# Altium schematic sheet Gateway_V2.0_Final_Schematic.SchDoc
size A2; SheetNumber: 1; SheetTotal: 1
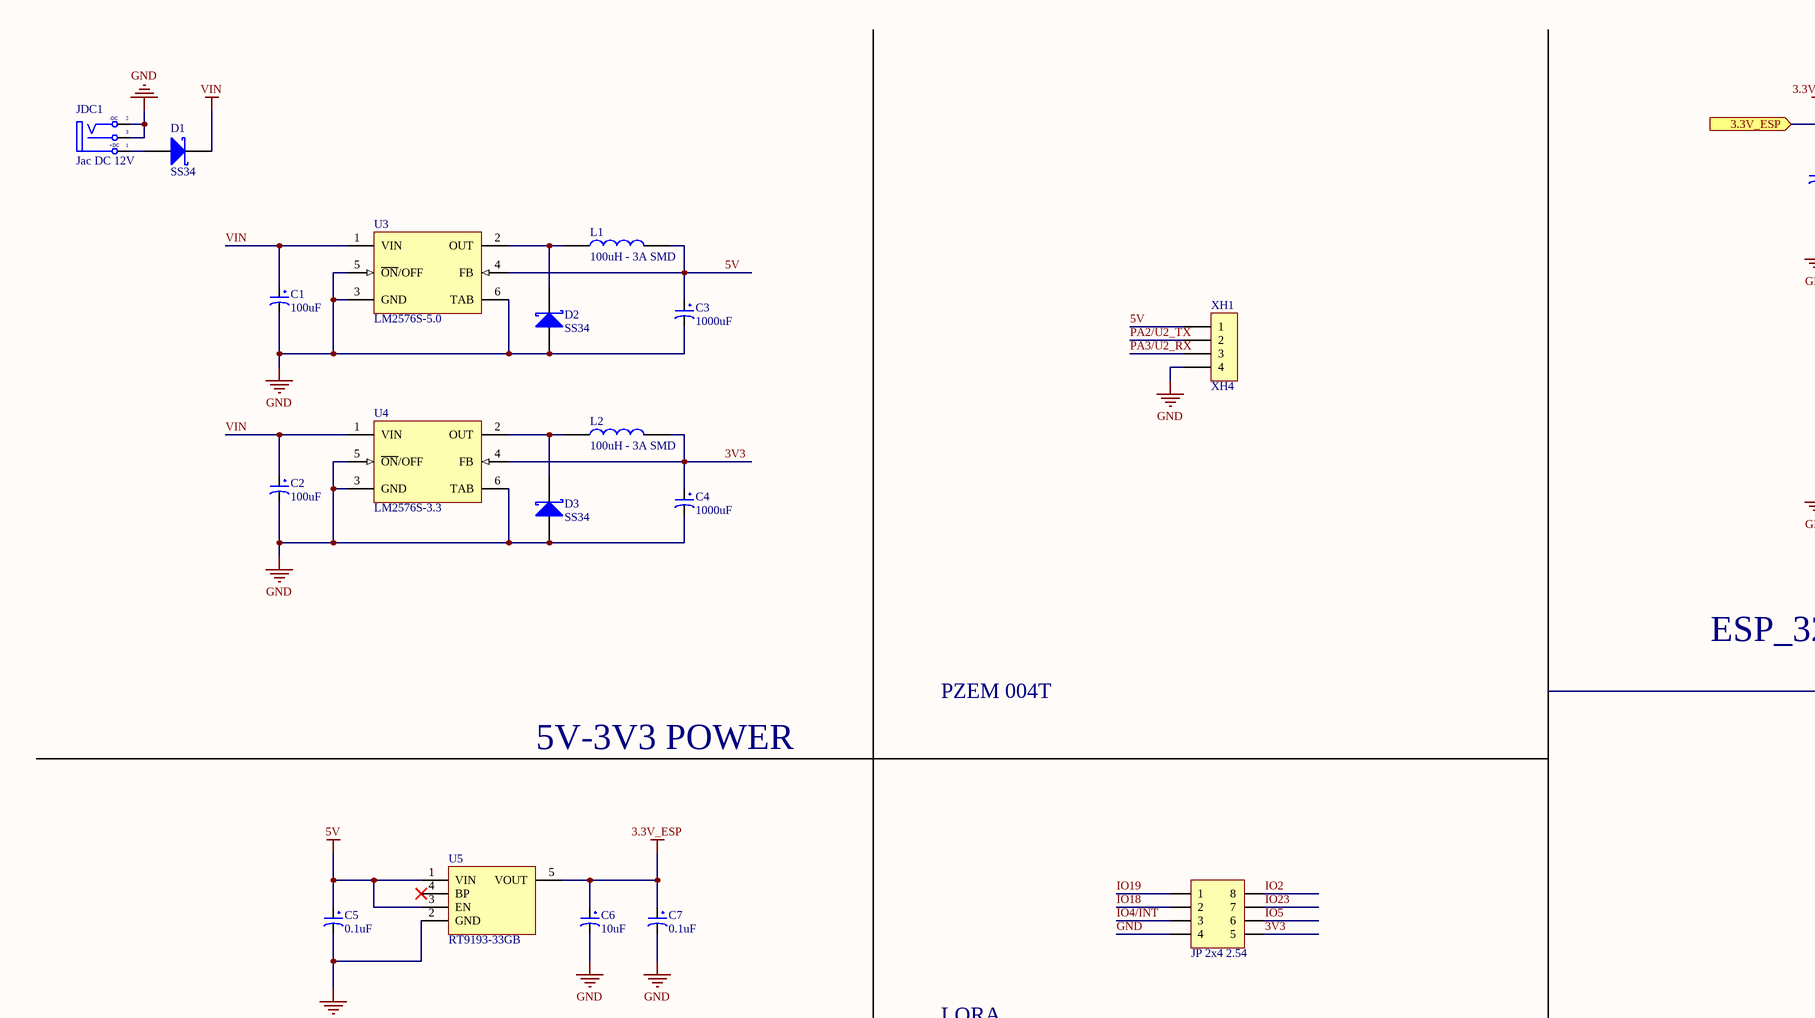
[diagram p0: Gateway_V2.0_Final_Schematic.SchDoc, top left]
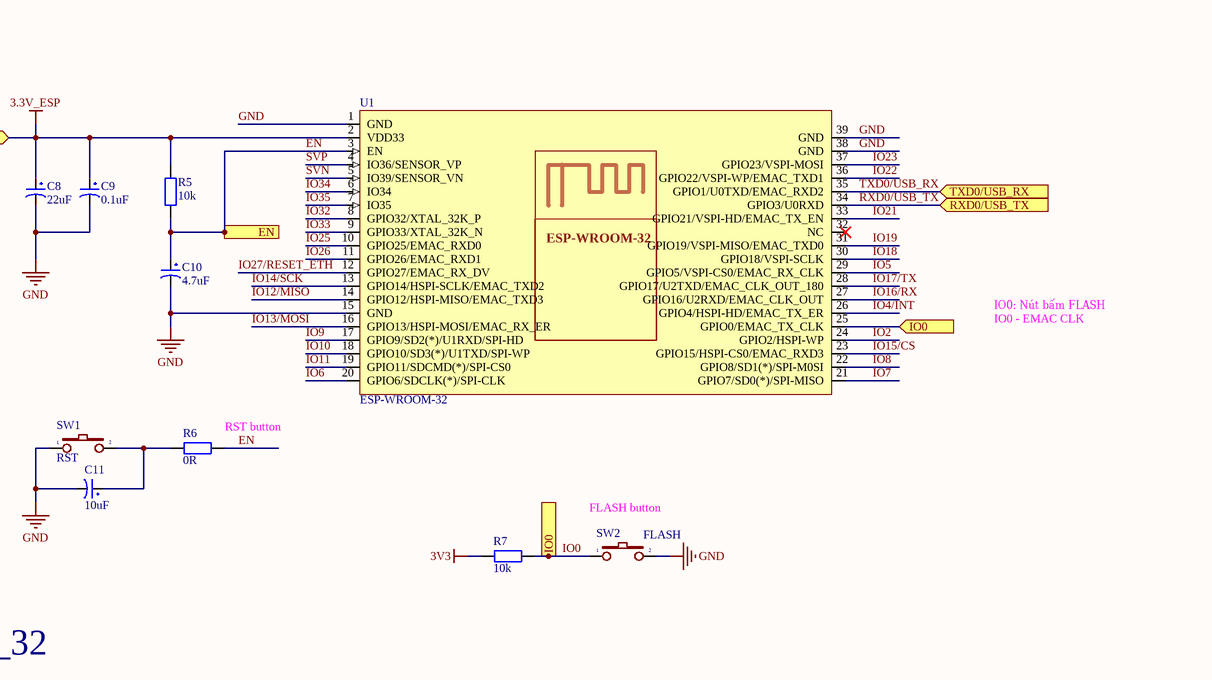
[diagram p1: Gateway_V2.0_Final_Schematic.SchDoc, top right]
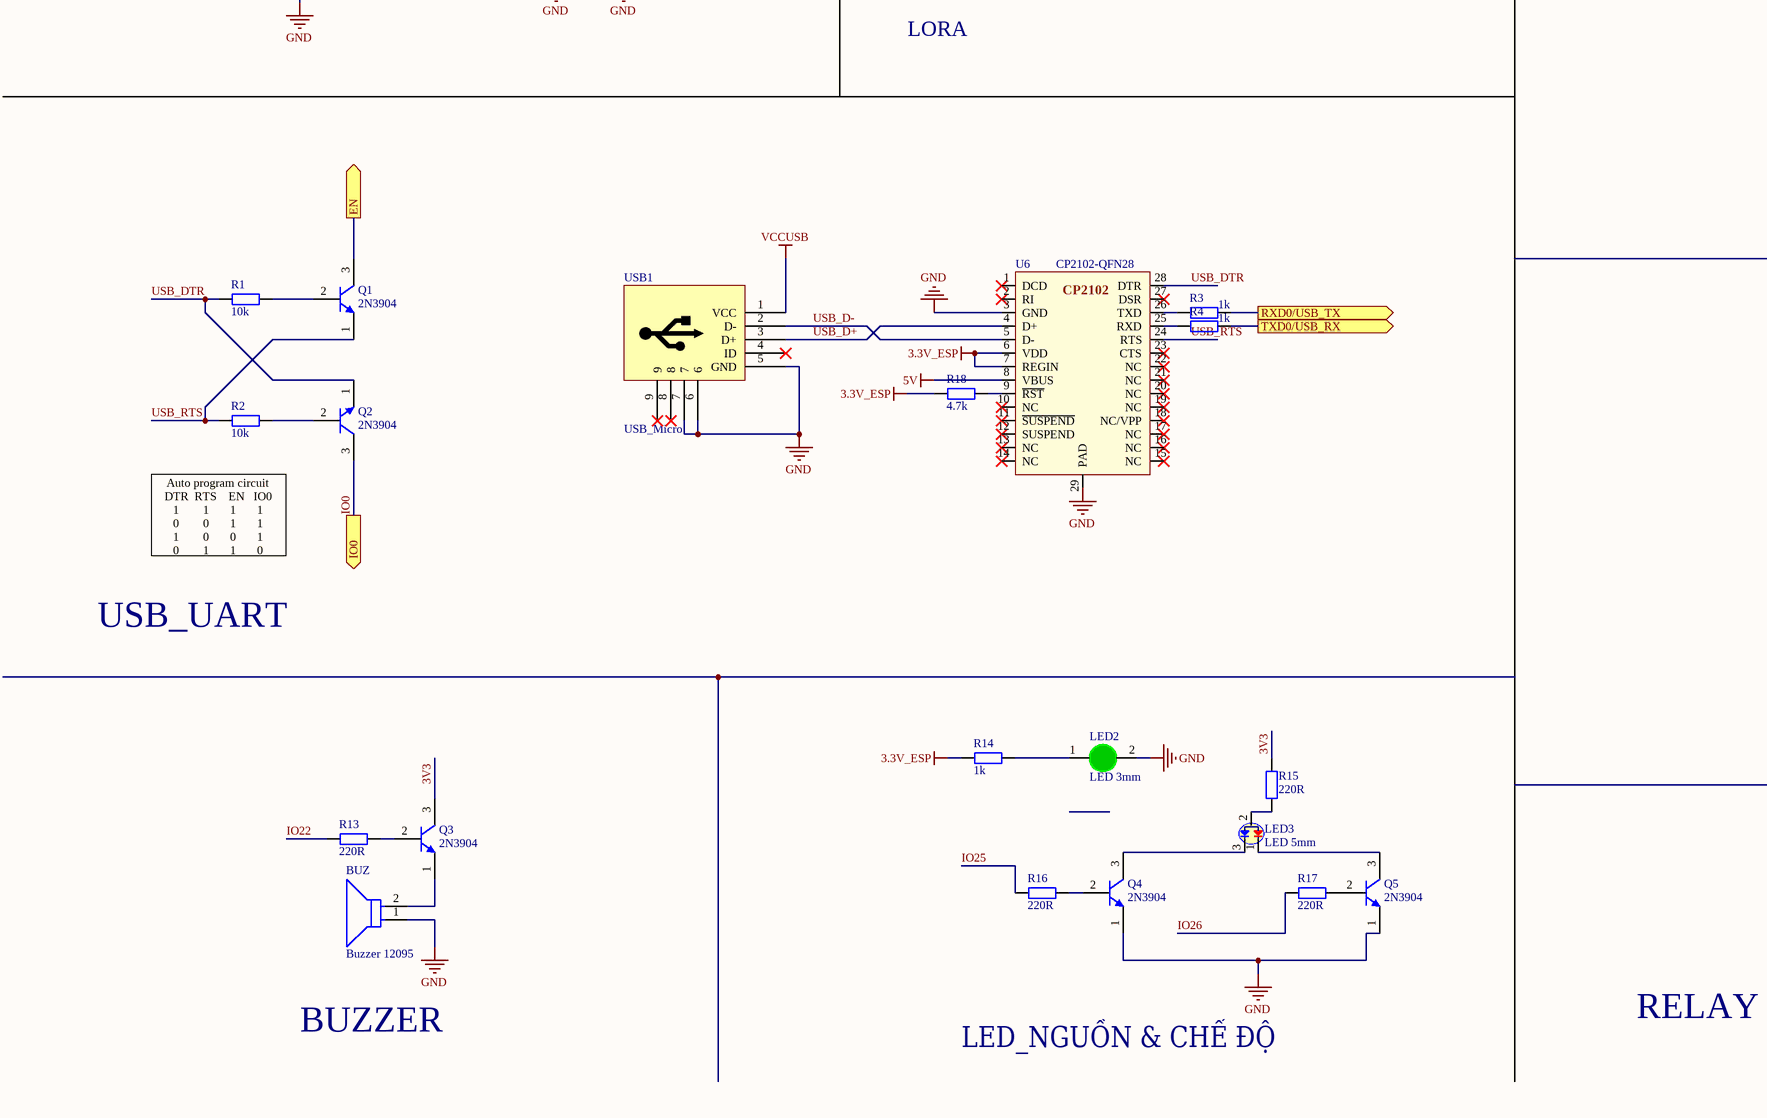
[diagram p2: Gateway_V2.0_Final_Schematic.SchDoc, bottom left]
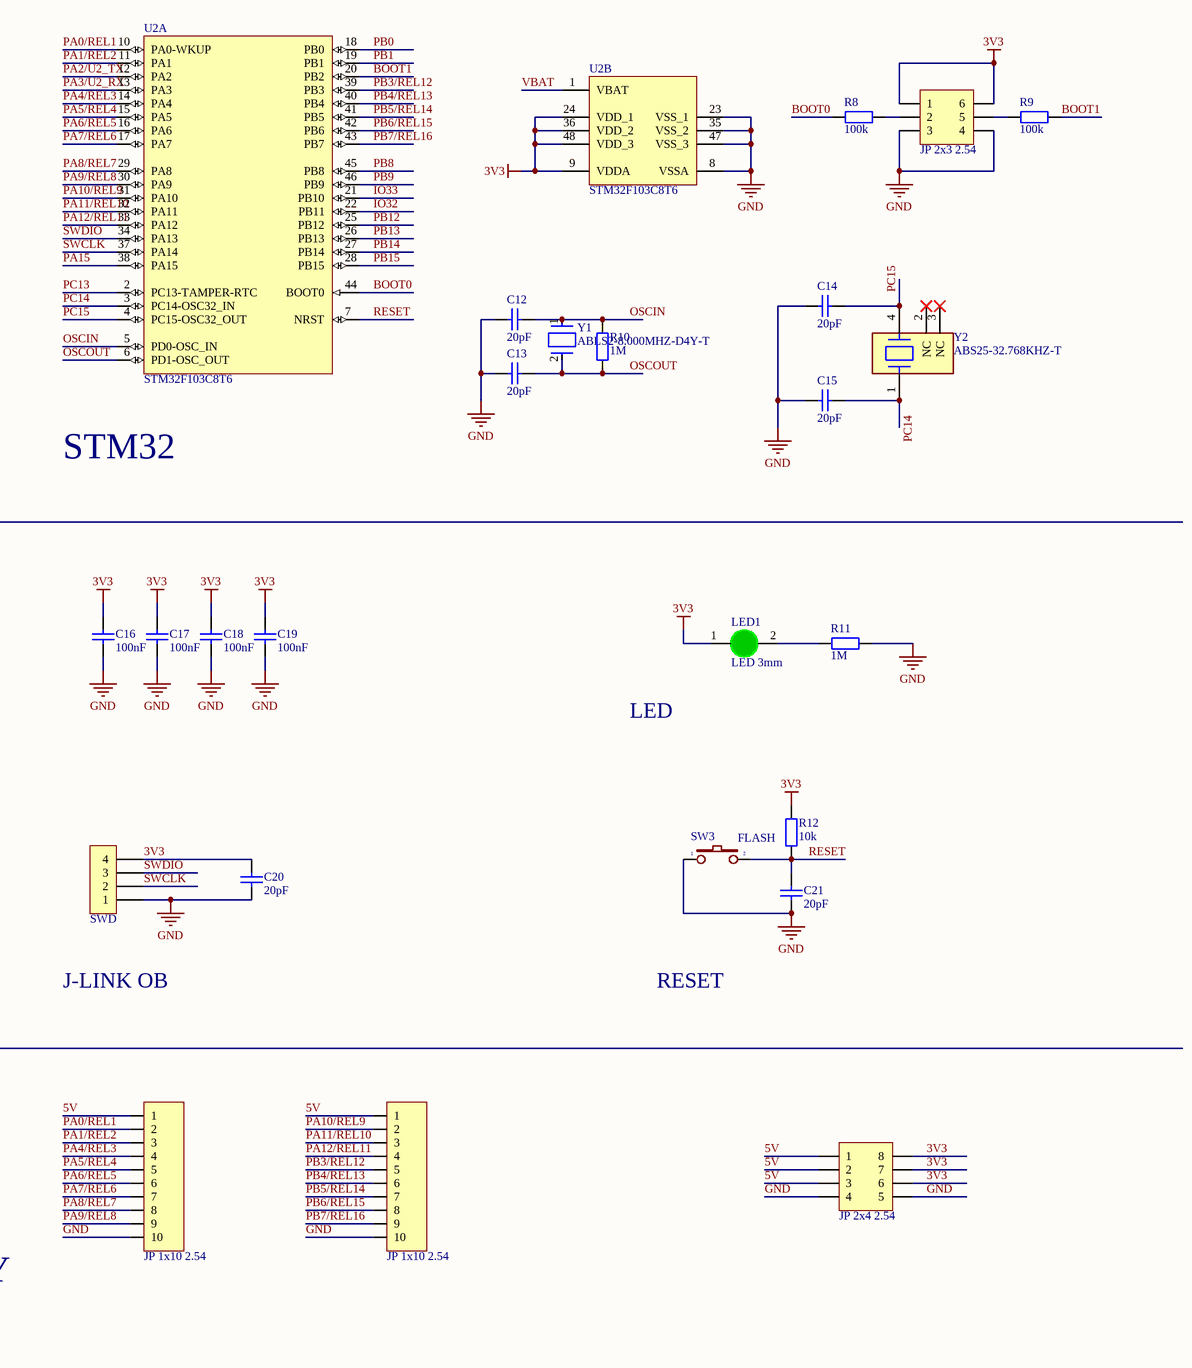
[diagram p3: Gateway_V2.0_Final_Schematic.SchDoc, bottom right]

## Parts
(Parts that share a designator on the sheet are numbered #1, #2 ... from top to bottom, then left to right.)
BUZ  Buzzer 12095  [FP-MCKPX-G1203A-K4056-MFG]
C1  100uF  [tu hoa 5mm]
C2  100uF  [tu hoa 5mm]
C3  1000uF  [tu hoa 8mm]
C4  1000uF  [tu hoa 8mm]
C5  0.1uF  [tu hoa 5mm]
C6  10uF  [tu hoa 4mm]
C7  0.1uF  [tu hoa 5mm]
C8  22uF  [tu hoa 5mm]
C9  0.1uF  [tu hoa 5mm]
C10  4.7uF  [tu hoa 5mm]
C11  10uF  [tu hoa 4mm]
C12  20pF  [tu gom]
C13  20pF  [tu gom]
C14  20pF  [tu gom]
C15  20pF  [tu gom]
C16  100nF  [tu tantalum dip5.08]
C17  100nF  [tu tantalum dip5.08]
C18  100nF  [tu tantalum dip5.08]
C19  100nF  [tu tantalum dip5.08]
C20  20pF  [tu gom]
C21  20pF  [tu gom]
D1  SS34  [SS14]
D2  SS34  [SS14]
D3  SS34  [SS14]
H1  SWD  [Header 4P DC 2.54]
JDC1  Jac DC 12V  [DC-IN]
JP3  JP 2x3 2.54  [JP 2x3 DT]
JP4  JP 1x10 2.54  [JP 1x10 DT]
JP5  JP 1x10 2.54  [JP 1x10 DT]
JP6  JP 2x4 2.54  [JP 2x4 CT]
L1  100uH - 3A SMD  [Cuon Cam 12x12x10]
L2  100uH - 3A SMD  [Cuon Cam 12x12x10]
LED1  LED 3mm  [LED-3MM-GREEN]
LED2  LED 3mm  [LED-3MM-GREEN]
LED3  LED 5mm  [LED-5MM 2 MAU]
LORA  JP 2x4 2.54  [JP 2x4 CT]
Q1  2N3904  [ONSC-TO-92-3-29-11]
Q2  2N3904  [ONSC-TO-92-3-29-11]
Q3  2N3904  [ONSC-TO-92-3-29-11]
Q4  2N3904  [ONSC-TO-92-3-29-11]
Q5  2N3904  [ONSC-TO-92-3-29-11]
R1  10k  [tro vach 1/4w]
R2  10k  [tro vach 1/4w]
R3  1k  [tro vach 1/4w]
R4  1k  [tro vach 1/4w]
R5  10k  [tro vach 1/4w]
R6  0R  [tro vach 1/4w]
R7  10k  [tro vach 1/4w]
R8  100k  [tro vach 1/4w]
R9  100k  [tro vach 1/4w]
R10  1M  [tro vach 1/4w]
R11  1M  [tro vach 1/4w]
R12  10k  [tro vach 1/4w]
R13  220R  [tro vach 1/4w]
R14  1k  [tro vach 1/4w]
R15  220R  [tro vach 1/4w]
R16  220R  [tro vach 1/4w]
R17  220R  [tro vach 1/4w]
R18  4.7k  [tro vach 1/4w]
SW1  RST  [Button 3x4mm]
SW2  FLASH  [Button 3x4mm]
SW3  FLASH  [Button 3x4mm]
U1  ESP-WROOM-32  [ESP32 WROOM]
U2#1  STM32F103C8T6  [STM-LQFP48_L]  (part A of 2)
U2#2  STM32F103C8T6  [STM-LQFP48_L]  (part B of 2)
U3  LM2576S-5.0  [KTT0005B_N]
U4  LM2576S-3.3  [TS5B_M]
U5  RT9193-33GB  [SOT23-5]
U6  CP2102-QFN28  [CP2102-QFN28]
USB1  USB_Micro  [USB_MICRO_B - Digikey]
XH1  XH4  [XH4/2.54mm/90]
Y1  ABLS2-8.000MHZ-D4Y-T  [FP-ABLS2-MFG]
Y2  ABS25-32.768KHZ-T  [FP-ABS25-MFG]

## Ports
3.3V_ESP (in), EN (in, see Gateway_V2.0_Final_Schematic[2C]), EN (out, see Gateway_V2.0_Final_Schematic[6A]), IO0 (in, see Gateway_V2.0_Final_Schematic[2C], Gateway_V2.0_Final_Schematic[7B]), IO0 (out, see Gateway_V2.0_Final_Schematic[2C], Gateway_V2.0_Final_Schematic[8A]), IO0 (out, see Gateway_V2.0_Final_Schematic[7B], Gateway_V2.0_Final_Schematic[8A]), RXD0/USB_TX (in, see Gateway_V2.0_Final_Schematic[4C]), RXD0/USB_TX (out, see Gateway_V2.0_Final_Schematic[8A]), TXD0/USB_RX (in, see Gateway_V2.0_Final_Schematic[4C]), TXD0/USB_RX (out, see Gateway_V2.0_Final_Schematic[8A])

## Nets
3.3V_ESP: C6.1 C7.1 C8.1 C9.1 R5.1 R14.1 R18.1 U1.2(VDD33) U5.5(VOUT) U6.6(VDD) U6.7(REGIN) ; port 3.3V_ESP
3V3: C4.1 C16.1 C17.1 C18.1 C19.1 C20.1 H1.4 JP3.1 JP3.6 JP6.6 JP6.7 JP6.8 L2.2 LED1.1(A) LORA.5 Q3.3(C) R7.1 R12.2 R15.2 U2#2.9(VDDA) U2#2.24(VDD_1) U2#2.36(VDD_2) U2#2.48(VDD_3) U4.4(FB)
5V: C3.1 C5.1 JP4.1 JP5.1 JP6.1 JP6.2 JP6.3 L1.2 U3.4(FB) U5.1(VIN) U5.3(EN) U6.8(VBUS) XH1.1
GND: BUZ.1(C) C1.2 C2.2 C3.2 C4.2 C5.2 C6.2 C7.2 C8.2 C9.2 C10.2 C11.2 C12.1 C13.2 C14.2 C15.2 C16.2 C17.2 C18.2 C19.2 C20.2 C21.2 D2.1(A) D3.1(A) H1.1 JDC1.2(TN) JDC1.3(S) JP3.3 JP3.4 JP4.10 JP5.10 JP6.4 JP6.5 LED2.2(K) LORA.4 Q4.1(E) Q5.1(E) R11.2 SW1.1 SW2.2 SW3.1 U1.1(GND) U1.15(GND) U1.38(GND) U1.39(GND) U2#2.8(VSSA) U2#2.23(VSS_1) U2#2.35(VSS_2) U2#2.47(VSS_3) U3.3(GND) U3.5(~{ON}/OFF) U3.6(TAB) U4.3(GND) U4.5(~{ON}/OFF) U4.6(TAB) U5.2(GND) U6.3(GND) U6.29(PAD) USB1.5(GND) USB1.6 USB1.7 XH1.4
VCCUSB: USB1.1(VCC)
VIN: C1.1 C2.1 D1.2(K) U3.1(VIN) U4.1(VIN)
BOOT0: R8.1 U2#1.44(BOOT0)
BOOT1: R9.2 U2#1.20(PB2)
EN: C10.1 Q1.3(C) R5.2 R6.2 U1.3(EN) ; port EN
IO0: Q2.3(C) R7.2 SW2.1 U1.25(GPIO0/EMAC_TX_CLK) ; port IO0
IO2: LORA.8 U1.24(GPIO2/HSPI-WP)
IO4/INT: LORA.3 U1.26(GPIO4/HSPI-HD/EMAC_TX_ER)
IO5: LORA.6 U1.29(GPIO5/VSPI-CS0/EMAC_RX_CLK)
IO6: U1.20(GPIO6/SDCLK(*)/SPI-CLK)
IO7: U1.21(GPIO7/SD0(*)/SPI-MISO)
IO8: U1.22(GPIO8/SD1(*)/SPI-M0SI)
IO9: U1.17(GPIO9/SD2(*)/U1RXD/SPI-HD)
IO10: U1.18(GPIO10/SD3(*)/U1TXD/SPI-WP)
IO11: U1.19(GPIO11/SDCMD(*)/SPI-CS0)
IO12/MISO: U1.14(GPIO12/HSPI-MISO/EMAC_TXD3)
IO13/MOSI: U1.16(GPIO13/HSPI-MOSI/EMAC_RX_ER)
IO14/SCK: U1.13(GPIO14/HSPI-SCLK/EMAC_TXD2)
IO15/CS: U1.23(GPIO15/HSPI-CS0/EMAC_RXD3)
IO16/RX: U1.27(GPIO16/U2RXD/EMAC_CLK_OUT)
IO17/TX: U1.28(GPIO17/U2TXD/EMAC_CLK_OUT_180)
IO18: LORA.2 U1.30(GPIO18/VSPI-SCLK)
IO19: LORA.1 U1.31(GPIO19/VSPI-MISO/EMAC_TXD0)
IO21: U1.33(GPIO21/VSPI-HD/EMAC_TX_EN)
IO22: R13.1 U1.36(GPIO22/VSPI-WP/EMAC_TXD1)
IO23: LORA.7 U1.37(GPIO23/VSPI-MOSI)
IO25: R16.1 U1.10(GPIO25/EMAC_RXD0)
IO26: R17.1 U1.11(GPIO26/EMAC_RXD1)
IO27/RESET_ETH: U1.12(GPIO27/EMAC_RX_DV)
IO32: U1.8(GPIO32/XTAL_32K_P) U2#1.22(PB11)
IO33: U1.9(GPIO33/XTAL_32K_N) U2#1.21(PB10)
IO34: U1.6(IO34)
IO35: U1.7(IO35)
OSCIN: C12.2 R10.2 U2#1.5(PD0-OSC_IN) Y1.1
OSCOUT: C13.1 R10.1 U2#1.6(PD1-OSC_OUT) Y1.2
PA0/REL1: JP4.2 U2#1.10(PA0-WKUP)
PA1/REL2: JP4.3 U2#1.11(PA1)
PA2/U2_TX: U2#1.12(PA2) XH1.2
PA3/U2_RX: U2#1.13(PA3) XH1.3
PA4/REL3: JP4.4 U2#1.14(PA4)
PA5/REL4: JP4.5 U2#1.15(PA5)
PA6/REL5: JP4.6 U2#1.16(PA6)
PA7/REL6: JP4.7 U2#1.17(PA7)
PA8/REL7: JP4.8 U2#1.29(PA8)
PA9/REL8: JP4.9 U2#1.30(PA9)
PA10/REL9: JP5.2 U2#1.31(PA10)
PA11/REL10: JP5.3 U2#1.32(PA11)
PA12/REL11: JP5.4 U2#1.33(PA12)
PA15: U2#1.38(PA15)
PB0: U2#1.18(PB0)
PB1: U2#1.19(PB1)
PB3/REL12: JP5.5 U2#1.39(PB3)
PB4/REL13: JP5.6 U2#1.40(PB4)
PB5/REL14: JP5.7 U2#1.41(PB5)
PB6/REL15: JP5.8 U2#1.42(PB6)
PB7/REL16: JP5.9 U2#1.43(PB7)
PB8: U2#1.45(PB8)
PB9: U2#1.46(PB9)
PB12: U2#1.25(PB12)
PB13: U2#1.26(PB13)
PB14: U2#1.27(PB14)
PB15: U2#1.28(PB15)
PC13: U2#1.2(PC13-TAMPER-RTC)
PC14: C15.1 U2#1.3(PC14-OSC32_IN) Y2.1
PC15: C14.1 U2#1.4(PC15-OSC32_OUT) Y2.4
RESET: C21.1 R12.1 SW3.2 U2#1.7(NRST)
RXD0/USB_TX: R3.2 U1.34(GPIO3/U0RXD) ; port RXD0/USB_TX
SVN: U1.5(IO39/SENSOR_VN)
SVP: U1.4(IO36/SENSOR_VP)
SWCLK: H1.2 U2#1.37(PA14)
SWDIO: H1.3 U2#1.34(PA13)
TXD0/USB_RX: R4.2 U1.35(GPIO1/U0TXD/EMAC_RXD2) ; port TXD0/USB_RX
USB_D+: U6.4(D+) USB1.3(D+)
USB_D-: U6.5(D-) USB1.2(D-)
USB_DTR: Q2.1(E) R1.1 U6.28(DTR)
USB_RTS: Q1.1(E) R2.1 U6.24(RTS)
VBAT: U2#2.1(VBAT)
NetBUZ_2: BUZ.2(A) Q3.1(E)
NetC11_1: C11.1 R6.1 SW1.2
NetD1_1: D1.1(A) JDC1.1(T)
NetD2_2: D2.2(K) L1.1 U3.2(OUT)
NetD3_2: D3.2(K) L2.1 U4.2(OUT)
NetJP3_2: JP3.2 R8.2
NetJP3_5: JP3.5 R9.1
NetLED1_2: LED1.2(K) R11.1
NetLED2_1: LED2.1(A) R14.2
NetLED3_1: LED3.1(D) Q5.3(C)
NetLED3_2: LED3.2(Katot) R15.1
NetLED3_3: LED3.3(X) Q4.3(C)
NetQ1_2: Q1.2(B) R1.2
NetQ2_2: Q2.2(B) R2.2
NetQ3_2: Q3.2(B) R13.2
NetQ4_2: Q4.2(B) R16.2
NetQ5_2: Q5.2(B) R17.2
NetR3_1: R3.1 U6.26(TXD)
NetR4_1: R4.1 U6.25(RXD)
NetR18_2: R18.2 U6.9(~{RST})

Not connected (* = marked no-connect by the designer): U1 32(NC)*; U5 4(BP)*; U6 1(DCD)* 2(RI)* 10(NC)* 11(~{SUSPEND})* 12(SUSPEND)* 13(NC)* 14(NC)* 15(NC)* 16(NC)* 17(NC)* 18(NC/VPP)* 19(NC)* 20(NC)* 21(NC)* 22(NC)* 23(CTS)* 27(DSR)*; USB1 4(ID)* 8* 9*; Y2 2(NC)* 3(NC)*

## Notes on the sheet
- IO0: Nút bấm FLASH
- IO0 - EMAC CLK
- (near R6) RST button
- (near SW2) FLASH button
- ESP_32
- PZEM 004T
- 5V-3V3 POWER
- LORA
- STM32
- LED
- Auto program circuit
  DTR  RTS    EN   IO0
  1        1       1       1
  0        0       1       1
  1        0       0       1
  0        1       1       0
- USB_UART
- J-LINK OB
- RESET
- BUZZER
- LED_NGUỒN & CHẾ ĐỘ
- RELAY
- (in symbol DCIN) -DC; +DC

## Library data of the parts
BUZ = CMP-12433-000001-1: MAGNETIC BUZZER AND TRANSDUCER - More Details; Manufacturer Part Number: MCKPX-G1203A-K4056; Manufacturer: Multicomp Pro; Operating Supply Voltage: 3V; Current: 30mA; Frequency: 2300Hz; Max Supply Voltage: 5V; Min Supply Voltage: 2V; Standoff Height: 0.5mm; ComponentLink2Description: Datasheet; ComponentLink2URL: http://www.farnell.com/datasheets/1498149.pdf?_ga=2.17855225.1157923166.1572356775-536200964.1569240579; Temperature Range High: +70°C; Device Class L2: Audio Products; Temperature Range Low: -20°C; Package: 0; Temperature: -20°C to +70°C; Category: Speak; Octopart: https://octopart.com/mckpx-g1203a-k4056-multicomp-12157154; RoHS: TRUE; Lead Free: Yes; Height: 9.5mm; Device Class L1: Electromechanical; Automotive: No; Device Class L3: Buzzers
C1 C2 = Tu Hoa 100uF 16V 5x7: Cắm; Don_Vi: Con; So_Chan: 2; Ten_Linh_Kien: Tụ Hóa 100uF 16V 5x7MM; Ma_Hang: MH001347; Chung_Loai: Cắm; Kieu_Chan: *
C3 C4 = Tu Hoa 1000uF 16V 8x20: Cắm; Don_Vi: Con; So_Chan: 2; Ten_Linh_Kien: Tụ Hóa 1000uF 16V 8x20MM; Ma_Hang: MH008300; Chung_Loai: Cắm; Kieu_Chan: *
C5 C7 C9 = Tu Hoa 0.1uF 50V 5x11: Cắm; Don_Vi: Con; So_Chan: 2; Ten_Linh_Kien: Tụ Hóa 0.1uF 50V; Ma_Hang: MH006853; Chung_Loai: Cắm; Kieu_Chan: *
C6 C11 = Tu Hoa 10uF 25V 4x7: Cắm; So_Chan: 2; Ten_Linh_Kien: Tụ Hóa 10uF 25V 4x7MM; Don_Vi: Con; Ma_Hang: MH001349; Chung_Loai: Cắm; Kieu_Chan: *
C8 = Tu Hoa 22uF 35V 5x11: Cắm; Don_Vi: Con; So_Chan: 2; Ten_Linh_Kien: Tụ Hóa 22uF 35V 5x11MM; Ma_Hang: MH001350; Chung_Loai: Cắm; Kieu_Chan: *
C10 = Tu Hoa 4.7uF 50V 5x11: Cắm; Don_Vi: Con; So_Chan: 2; Ten_Linh_Kien: Tụ Hóa 4.7uF 50V 5x11MM; Ma_Hang: MH001357; Chung_Loai: Cắm; Kieu_Chan: *
C12-C15 C20 C21 = Tu gom 20pF 50V: Căm; Chung_Loai: Cắm; So_Chan: 2; Ten_Linh_Kien: Tụ gốm 20P 50V; Don_Vi: Con; Ma_Hang: MH004768; Kieu_Chan: *
C16-C19 = Tu tantalum 100nF 50V 20% DIP5.08: Cắm; Don_Vi: Con; So_Chan: 2; Ten_Linh_Kien: Tụ tantalum 104-100nF 50V 20% DIP5.08 (sứ vàng)(10PCS); Ma_Hang: MH003955; Chung_Loai: Cắm; Kieu_Chan: *
D1-D3 = D Schottky: Schottky Diode; Published: 8-Jun-2000; LatestRevisionDate: 17-Jul-2002; LatestRevisionNote: Re-released for DXP Platform.; PackageReference: SMB; Publisher: Altium Limited; PackageDescription: DO-214-AA/SMB; 2 C-Bend Leads; Body 5.3 x 3.6 mm, inc. leads (LxW); Code_JEDEC: DO-214-AA
H1 = Header 4P 2.54 Duc Cong: Cắm; Ten_Linh_Kien: Header 4P XH2.54-4P Đực Cong; Don_Vi: Con; Ma_Hang: MH001310; Chung_Loai: Cắm
JDC1 = DCIN: Jac DC input; Value: Jac DC
JP3 = JP 2x3 2.54 Duc Thang: Cắm; Ten_Linh_Kien: Jump Đôi Đực 2.54MM 2x40P Thẳng 11MM; Don_Vi: Con; Ma_Hang: MH002686; Ghi_Chu: *; Kieu_Chan: *; Chung_Loai: Cắm
JP4 JP5 = JP 1x10 2.54 Duc Thang: Cắm; Ten_Linh_Kien: Jump Đơn Đực 2.54MM 1x40P Thẳng 11MM; Don_Vi: Con; Ma_Hang: MH000903; Ghi_Chu: *; Kieu_Chan: *; Chung_Loai: Cắm
JP6 LORA = JP 2x4 2.54 Cai Thang: Cắm; Ten_Linh_Kien: Jump Đôi Cái 2.54MM 2x20P Thẳng; Don_Vi: Con; Ma_Hang: MH008647; Ghi_Chu: *; Kieu_Chan: *; Chung_Loai: Cắm
L1 L2 = CUON CAM 100uH SMD: Dán; Don_Vi: Con; Ma_Hang: MH003999; Ten_Linh_Kien: Cuộn Cảm 100uH 7x7x4MM CD74; Ma_Hang: *; Kieu_Chan: *; Chung_Loai: Dán
LED1 LED2 = LED 3mm Xanh La: Cắm; Don_Vi: Con; Ma_Hang: MH001054; Ten_Linh_Kien: Led 3MM Phủ Xanh (10c); Ghi_Chu: *; Kieu_Chan: *; Chung_Loai: Cắm
LED3 = LED 5mm 2 mau Anot chung: Cắm; Don_Vi: Con; Ma_Hang: MH001231; Ten_Linh_Kien: Led 5MM 2 Mầu Anot Xanh Đỏ (10c); Ghi_Chu: *; Kieu_Chan: *; Chung_Loai: Cắm
Q1-Q5 = CMP-2000-05562-1: General Purpose Transistor, NPN Silicon, 200 mA, 60 V, -55 to 150 degC, 3-Pin TO-92, RoHS, Bulk; Manufacturer: ONSemiconductor; Emitter- Base Voltage VEBO: 6V; Maximum Power Dissipation: 625mW; Maximum DC Collector Current: 0.2A; Collector- Emitter Voltage VCEO Max: 40V; Collector- Base Voltage VCBO: 60V; DC Collector/Base Gain hfe Min: 60; Configuration: Single; Collector-Emitter Saturation Voltage: 0.3V; Gain Bandwidth Product fT: 270MHz; Mounting Style: ThroughHole; Package / Case: TO-92-3(TO-226); Mounting Technology: ThroughHole; Minimum Operating Temperature: -65C; Datasheet Version: Rev. 8, 08/2012; Product Category: BipolarTransistors-BJT; Factory Pack Quantity: 5000; Transistor Polarity: NPN; Package Description: 3-Pin Transistor Outline, Body 4.825 x 3.685 mm, Pitch 1.27 mm; RoHS: Details; Datasheet URL: https://datasheet.ciiva.com/4725/2n3903-d-285841-4725808.pdf; Packaging: Bulk; Maximum Operating Temperature: +150C; Package Reference: TO-92-3-29-11; Brand: ONSemiconductor; Manufacturer URL: http://www.onsemi.com/
R1 R2 R7 R12 = Tro Vach 1/4W 5% 10k: Căm; Chung_Loai: Cắm; Don_Vi: Con; So_Chan: 2; Ten_Linh_Kien: Trở Vạch 1/4w 5% 10K; Ma_Hang: MH007354; Kieu_Chan: *
R3 R4 R14 R15 = Tro Vach 1/4W 5% 1k: Cắm; Don_Vi: Con; So_Chan: 2; Ten_Linh_Kien: Trở Vạch 1/4w 5% 1k; Ma_Hang: MH007390; Chung_Loai: Cắm; Kieu_Chan: *
R5 R6 = Tro Vach 1/4W 1% 10k: Cắm; Don_Vi: Con; So_Chan: 2; Ten_Linh_Kien: Trở Vạch 1/4w 1% 10k; Ma_Hang: MH006349; Chung_Loai: Cắm; Kieu_Chan: *
R8 R9 = Tro Vach 1/4W 5% 100k: Cắm; Don_Vi: Con; So_Chan: 2; Ten_Linh_Kien: Trở Vạch 1/4w 5% 100k; Ma_Hang: MH007352; Chung_Loai: Cắm; Kieu_Chan: *
R10 R11 = Tro Vach 1/4W 5% 1M: Cắm; So_Chan: 2; Don_Vi: Con; Ten_Linh_Kien: Trở Vạch 1/4w 5% 1M; Ma_Hang: MH007392; Chung_Loai: Cắm; Kieu_Chan: *
R13 R16 R17 = Tro Vach 1/4W 5% 220R: Cắm; Don_Vi: Con; So_Chan: 2; Ten_Linh_Kien: Trở Vạch 1/4w 5% 220R; Ma_Hang: MH007300; Chung_Loai: Cắm; Kieu_Chan: *
R18 = Tro Vach 1/4W 5% 4.7k: Cắm; Don_Vi: Con; So_Chan: 2; Ten_Linh_Kien: Trở Vạch 1/4w 5% 4.7k; Ma_Hang: MH007317; Chung_Loai: Cắm; Kieu_Chan: *
SW1-SW3 = SW2: SWITCH TACTILE SPST-NO 0.05A 12V; Digikey: CKN10384CT-ND
U1 = ESP-WROOM-32: ESP-WROOM-32 (8MB), WIFI MODULE 64 MBITS SPI FLASH; Digikey: 1904-1019-1-ND
U2#1 U2#2 = CMP-0237-00215-3: ARM Cortex-M3 32-bit MCU, 64 KB Flash, 20 KB Internal RAM, 37 I/Os, 48-pin LQFP, -40 to 85 degC, Tray; Supply Voltage(Vcc) min (V): 2; Internal RAM Size (kB): 20; FLASH Size (Prog) (kB): 64; A/D Converter: 2x12-bit (10 Channel); I/Os (High Current): 37; Operating Frequency(F) (Processor speed) (MHz): 72; Core: ARM Cortex-M3; ComponentLink3Description: Package Specification; Mounting Technology: Surface Mount; PartNumber: STM32F103C8T6; PackageReference: LQFP48; Packing: Tray; ComponentLink3URL: http://www.st.com/st-web-ui/static/active/en/resource/technical/document/datasheet/DM00058181.pdf; DatasheetVersion: Rev. 16; ComponentLink1URL: http://www.st.com/web/en/home.html; PackageVersion: Rev. 6, 06/2013; ComponentLink2URL: http://www.st.com/st-web-ui/static/active/en/resource/technical/document/datasheet/CD00161566.pdf; ComponentLink1Description: Manufacturer URL; ComponentLink2Description: Datasheet; PackageDescription: 48-Pin Low Profile Quad Flat Package, 7 x 7 mm Body, 0.5 mm Pitch
U3 = CMP-0069-00115-3: SIMPLE SWITCHER® 3A Step-Down Voltage Regulator, 5-pin TO-263; Manufacturer: Texas Instruments; PackageTopMarking: NSUZXYTTE#*LM2576S*-5.0 P+; PowerWise: N; ComponentLink1Description: Datasheet URL; CompType: Switcher; PinCount: 5; Code_JEDEC: MO-169-AB; PackageDescription: TO-263, Molded, .400 x .390 x .180in, 5 Lead, .067in Pitch, Surface Mount; ComponentLink1URL: http://www.ti.com/general/docs/lit/getliterature.tsp?genericPartNumber=LM2576&fileType=pdf; RoHS: N; PackageReference: KTT0005B
U4 = CMP-0069-00113-2: SIMPLE SWITCHER® 3A Step-Down Voltage Regulator, 5-pin TO-263; Manufacturer: National Semiconductor; PackageTopMarking: NSUZXYTTE#*LM2576S*-3.3 P+; PowerWise: N; ComponentLink2URL: http://www.national.com/pf/LM/LM2576.html; ComponentLink1URL: http://www.national.com/ds/LM/LM2576.pdf; Code_JEDEC: MO-169-AB; RoHS: N; ComponentLink3Description: TS5B Package Page; PackageReference: TS5B; CompType: Switcher; RevisionNote: Component URLs added; DatasheetVersion: Aug-2004; ComponentLink2Description: LM2576 Web Page; ComponentLink1Description: LM2576 Datasheet; PackageDescription: TO-263, Molded, .400 x .390 x .180in, 5 Lead, .067in Pitch, Surface Mount; ComponentLink3URL: http://www.national.com/packaging/folders/ts5b.html; PackageVersion: revD, Apr-2005; PinCount: 5
U5 = REG_5.5V-3.3V-0.3A-1W-SOT-23-5: Linear Voltage Regulator IC 1 Output 300mA SOT-23-5; Manufacturer: Richtek USA Inc.; Alternate Part Number-1: NA; Manufacturer Part Number: RT9193-33GB; Supplier-1: LCSC; Supplier Part Number-1: C15651; Case/Package: SOT-23-5
U6 = CP2102: USB Bridge, USB to UART USB 2.0 UART Interface 28-QFN (5x5); Digikey: 336-3694-ND; VNBuy: https://banlinhkien.vn/goods-2607-cp2102-qfn28.html
USB1 = USB_MINI: USB - micro B USB 2.0 Receptacle Connector 5 Position Surface Mount, Right Angle; Through Hole; BuyVN: https://banlinhkien.vn/goods-5145-microusb-mk5p-dip.html; Digikey: 609-4618-1-ND
Y1 = CMP-27762-001729-1: CRYSTAL 8.0000MHZ 18PF SMD; Series Resistance: 80R; Tolerance: 30ppm; Frequency: 8MHz; Operating Frequency: 8 MHz; Packaging: Tape and Reel; Number of Pins: 2; Mount: Surface Mount; Package Quantity: 1000; Series: ABLS2; Min Operating Temperature: -40°C; Termination: SMD/SMT; Load Capacitance: 18pF; Lead Free: Lead Free; Frequency Tolerance: 30ppm; RoHS Compliant: Yes; Length: 11.4mm; Width: 4.7mm; Height: 0.13inch; ESR (Equivalent Series Resistance): 80R; Max Operating Temperature: 85°C; Depth: 4.7mm; Frequency Stability: 30ppm
Y2 = CMP-2000-05037-2: CRYSTAL 32.7680KHZ 12.5PF SMD; ESR (Equivalent Series Resistance): 50kR; Tolerance: 20ppm; Width: 3.8mm; REACH SVHC: No SVHC; Load Capacitance: 12.5pF; Case/Package: SMD/SMT; Radiation Hardening: No; Series: ABS25; Number of Pins: 4; Mount: Surface Mount; RoHS Compliant: Yes; Packaging: Tape and Reel; Termination: SMD/SMT; Frequency Tolerance: 20ppm; Lead Free: Lead Free; Package Quantity: 1000; Min Operating Temperature: -40°C; Height: 0.098inch; Length: 8mm; Frequency: 32.768kHz; Max Operating Temperature: 85°C; Series Resistance: 50kR; Operating Frequency: 32.768 kHz; Depth: 3.8mm